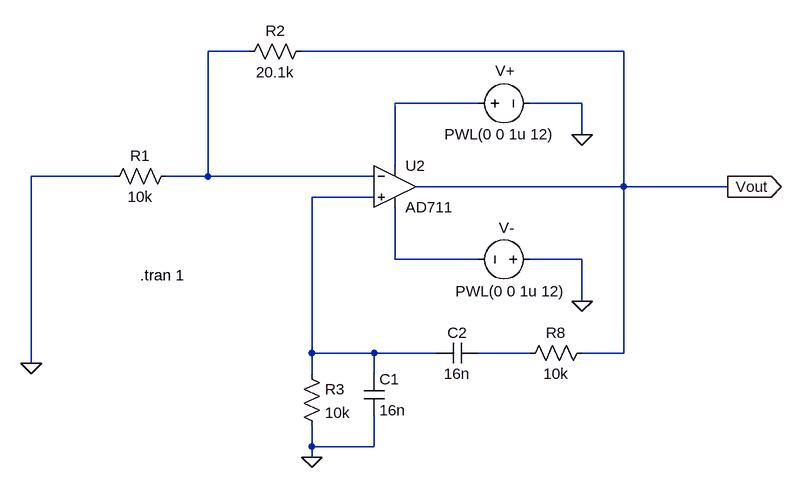
[diagram p0: schematic Puente Wien.asc]
Puente Wien.asc, the LTspice schematic file:
Version 4
SHEET 1 1432 1160
WIRE -480 -16 -544 -16
WIRE 96 -16 -400 -16
WIRE -128 64 -256 64
WIRE 32 64 -48 64
WIRE 32 112 32 64
WIRE -256 160 -256 64
WIRE -688 176 -816 176
WIRE -544 176 -544 -16
WIRE -544 176 -608 176
WIRE -288 176 -544 176
WIRE 96 192 96 -16
WIRE 96 192 -224 192
WIRE 256 192 96 192
WIRE -288 208 -384 208
WIRE -256 304 -256 224
WIRE -128 304 -256 304
WIRE 32 304 -48 304
WIRE 32 368 32 304
WIRE -384 448 -384 208
WIRE -288 448 -384 448
WIRE -192 448 -288 448
WIRE -48 448 -128 448
WIRE 96 448 96 192
WIRE 96 448 32 448
WIRE -816 464 -816 176
WIRE -384 480 -384 448
WIRE -288 480 -288 448
WIRE -384 592 -384 560
WIRE -288 592 -288 544
WIRE -288 592 -384 592
WIRE -384 608 -384 592
FLAG -816 464 0
FLAG 32 112 0
FLAG 32 368 0
FLAG 256 192 Vout
IOPIN 256 192 Out
FLAG -384 608 0
SYMBOL res -592 160 R90
WINDOW 0 0 56 VBottom 2
WINDOW 3 32 56 VTop 2
SYMATTR InstName R1
SYMATTR Value 10k
SYMBOL res -384 -32 R90
WINDOW 0 0 56 VBottom 2
WINDOW 3 32 56 VTop 2
SYMATTR InstName R2
SYMATTR Value 20.1k
SYMBOL res -400 464 R0
SYMATTR InstName R3
SYMATTR Value 10k
SYMBOL voltage -144 64 R270
WINDOW 123 0 0 Left 0
WINDOW 39 0 0 Left 0
WINDOW 0 50 43 VRight 2
WINDOW 3 -47 -36 VRight 2
SYMATTR InstName V+
SYMATTR Value PWL(0 0 1u 12)
SYMBOL voltage -32 304 R90
WINDOW 0 -49 40 VRight 2
WINDOW 3 49 -39 VRight 2
WINDOW 123 0 0 Left 0
WINDOW 39 0 0 Left 0
SYMATTR InstName V-
SYMATTR Value PWL(0 0 1u 12)
SYMBOL res 48 432 R90
WINDOW 0 0 56 VBottom 2
WINDOW 3 32 56 VTop 2
SYMATTR InstName R8
SYMATTR Value 10k
SYMBOL cap -304 480 R0
SYMATTR InstName C1
SYMATTR Value 16n
SYMBOL cap -192 464 R270
WINDOW 0 32 32 VTop 2
WINDOW 3 0 32 VBottom 2
SYMATTR InstName C2
SYMATTR Value 16n
SYMBOL OpAmps\\AD711 -256 128 R0
SYMATTR InstName U2
TEXT -648 328 Left 2 !.tran 1

The netlist it stands for:
* Puente Wien.asc
R1 N001 0 10k
R2 Vout N001 20.1k
R3 N003 0 10k
V+ N002 0 PWL(0 0 1u 12)
V- 0 N004 PWL(0 0 1u 12)
R8 Vout N005 10k
C1 N003 0 16n
C2 N003 N005 16n
XU2 N003 N001 N002 N004 Vout AD712  ; AD711, pins In+ In- V+ V- OUT
.tran 1
.lib ADI1.lib
.backanno
.end